# Altium schematic sheet Dhruvacube_LFR__PCB__Sheet_1_2023-06-07.schdoc
size 232 x 166 mm
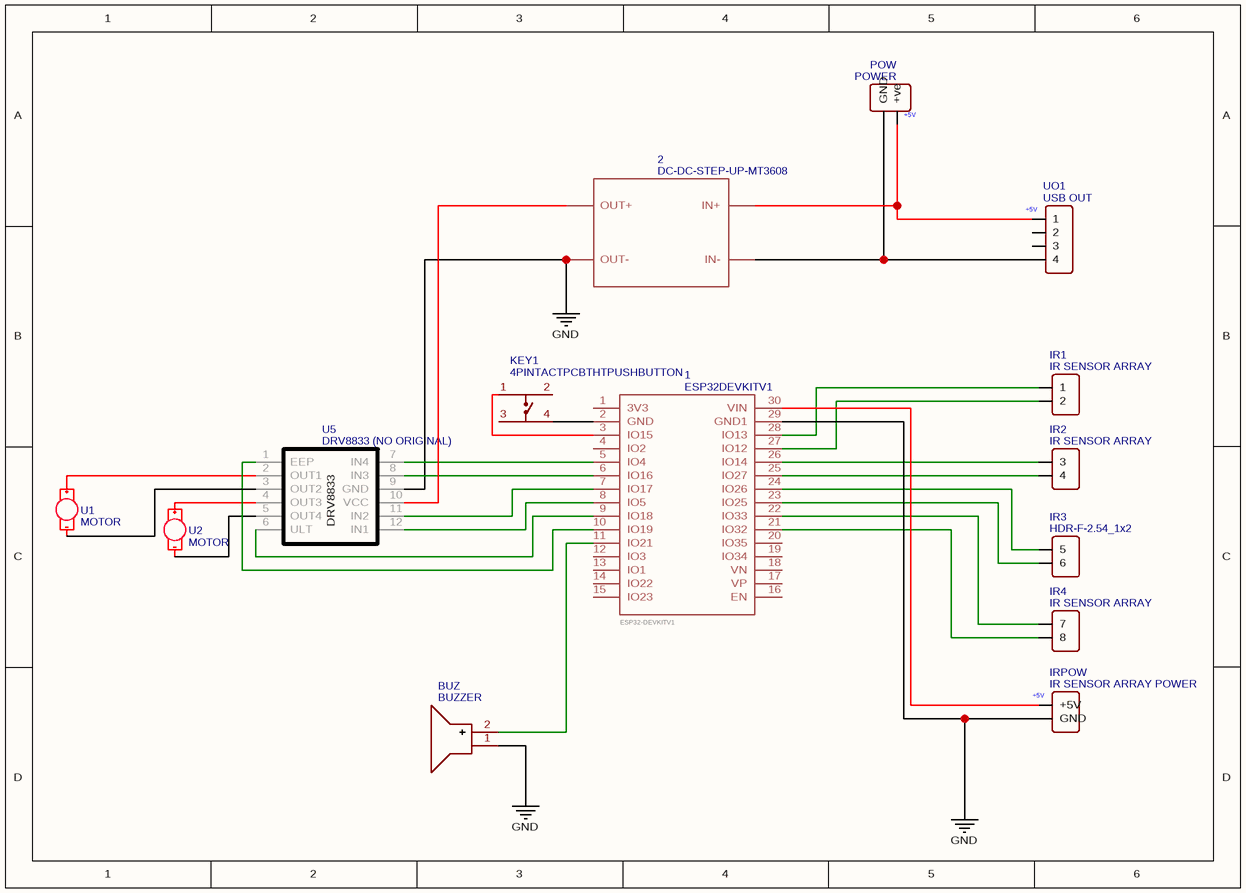
[diagram p0: Dhruvacube_LFR__PCB__Sheet_1_2023-06-07.schdoc]

## Parts
1  ESP32DEVKITV1  [ESP32-DEVKITV1]
2  DC-DC-STEP-UP-MT3608  [DC-DC-STEP-UP-MT3608]
BUZ  BUZZER  [BUZ-TH_BD12.0-P6.00-D0.9-RD]
IR1  IR SENSOR ARRAY  [HDR-F-2.54_1X2]
IR2  IR SENSOR ARRAY  [HDR-F-2.54_1X2]
IR3  HDR-F-2.54_1x2  [HDR-F-2.54_1X2]
IR4  IR SENSOR ARRAY  [HDR-F-2.54_1X2]
IRPOW  IR SENSOR ARRAY POWER  [HDR-F-2.54_1X2]
KEY1  4PINTACTPCBTHTPUSHBUTTON  [SW-SMD_4P-L6.0-W6.0-P4.50-LS10.0_TL3301EF160QG]
POW  POWER  [HDR-F-2.54_1X2]
U1  MOTOR  [VIBE-MOTOR-10MM]
U2  MOTOR  [VIBE-MOTOR-10MM]
U5  DRV8833 (NO ORIGINAL)  [DRV8833 (NO ORIGINAL)]
UO1  USB OUT  [HDR-F-2.54_1X4]

## Nets
GND: 1.29(GND1) 2.OUT- BUZ.1(-) IRPOW.2(GND) U5.9(GND)
Net1_2: 1.2(GND) KEY1.4
Net1_3: 1.3(IO15) KEY1.1
Net1_5: 1.5(IO4) U5.7(IN4)
Net1_6: 1.6(IO16) U5.8(IN3)
Net1_7: 1.7(IO17) U5.11(IN2)
Net1_8: 1.8(IO5) U5.12(IN1)
Net1_9: 1.9(IO18) U5.6(ULT)
Net1_10: 1.10(IO19) U5.1(EEP)
Net1_11: 1.11(IO21) BUZ.2(+)
Net1_21: 1.21(IO32) IR4.2(8)
Net1_22: 1.22(IO33) IR4.1(7)
Net1_23: 1.23(IO25) IR3.2(6)
Net1_24: 1.24(IO26) IR3.1(5)
Net1_25: 1.25(IO27) IR2.2(4)
Net1_26: 1.26(IO14) IR2.1(3)
Net1_27: 1.27(IO12) IR1.2
Net1_28: 1.28(IO13) IR1.1
Net1_30: 1.30(VIN) IRPOW.1(+5V)
Net2_IN+: 2.IN+ POW.1(+ve) UO1.1
Net2_IN-: 2.IN- POW.2(GND) UO1.4
Net2_OUT+: 2.OUT+ U5.10(VCC)
NetU1_+: U1.+ U5.2(OUT1)
NetU1_-: U1.- U5.3(OUT2)
NetU2_+: U2.+ U5.4(OUT3)
NetU2_-: U2.- U5.5(OUT4)

Not connected (* = marked no-connect by the designer): 1 1(3V3) 4(IO2) 12(IO3) 13(IO1) 14(IO22) 15(IO23) 16(EN) 17(VP) 18(VN) 19(IO34) 20(IO35); KEY1 2 3; UO1 2 3

## Notes on the sheet
- (near POW) +5V
- (near UO1) +5V
- (near IRPOW) +5V
- (in symbol DRV8833 (NO ORIGINAL)) DRV8833
- (in symbol ESP32DEVKITV1) ESP32-DEVKITV1

## Library data of the parts
1 = ESP32DEVKITV1: Contributor: Валентин Печенко; spicePre: ?; spiceSymbolName: ESP32DEVKITV1; BOM_Supplier: Digi-Key
2 = DC-DC-STEP-UP-MT3608: Contributor: arenda1234; spicePre: ?; spiceSymbolName: DC-DC-STEP-UP-MT3608
BUZ = BUZZER: BOM_Manufacturer: null; Contributor: lcsc; BOM_Supplier: LCSC; BOM_Supplier Part: C9900014030; BOM_Manufacturer Part: buzzer; BOM_JLCPCB Part Class: Extended Part; spicePre: B; spiceSymbolName: BUZZER
IR1 IR2 IR4 = IR SENSOR ARRAY: Contributor: LCEDA_Lib; BOM_Supplier Part: C49661; BOM_Supplier: LCSC; spicePre: H; spiceSymbolName: HDR-F-2.54_1x2
IR3 = HDR-F-2.54_1x2: Contributor: LCEDA_Lib; BOM_Supplier Part: C49661; BOM_Supplier: LCSC; spicePre: H; spiceSymbolName: HDR-F-2.54_1x2
IRPOW = IR SENSOR ARRAY POWER: Contributor: LCEDA_Lib; BOM_Supplier Part: C49661; BOM_Supplier: LCSC; spicePre: H; spiceSymbolName: HDR-F-2.54_1x2
KEY1 = 4PINTACTPCBTHTPUSHBUTTON: BOM_Manufacturer: null; Contributor: LCSC; BOM_Supplier: LCSC; BOM_Supplier Part: C9900003768; BOM_Manufacturer Part: 4pinTACTPCBTHTPushButton; BOM_JLCPCB Part Class: Extended Part; spicePre: K; spiceSymbolName: 4PINTACTPCBTHTPUSHBUTTON
POW = POWER: Contributor: LCEDA_Lib; BOM_Supplier Part: C49661; BOM_Supplier: LCSC; spicePre: H; spiceSymbolName: HDR-F-2.54_1x2
U1 U2 = MOTOR: Contributor: Tuấn Phạm; spicePre: U; spiceSymbolName: MOTOR
U5 = DRV8833 (NO ORIGINAL): Contributor: PiterSantaCruz; spicePre: U; spiceSymbolName: DRV8833 (NO ORIGINAL)
UO1 = USB OUT: Contributor: LCEDA_Lib; BOM_Supplier Part: C225501; BOM_Supplier: LCSC; spicePre: H; spiceSymbolName: HDR-F-2.54_1x4